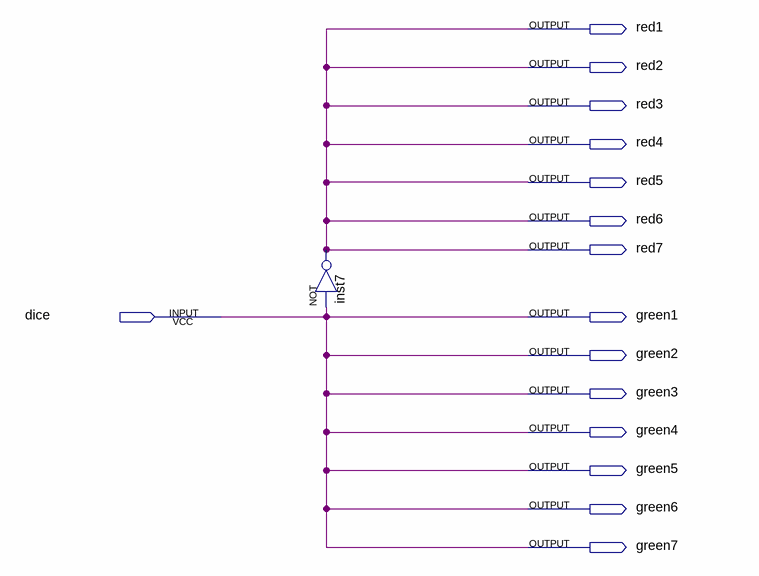
[diagram p0: schematic sheet]
// Quartus schematic dice.bdf as structural Verilog: 1 symbols, 15 pins
module dice (
  input  dice,
  output red1,
  output red2,
  output red3,
  output red4,
  output red5,
  output red6,
  output red7,
  output green1,
  output green2,
  output green3,
  output green4,
  output green5,
  output green6,
  output green7
);

  not inst7 (red1, dice);

  assign green1 = dice;
  assign green2 = dice;
  assign green3 = dice;
  assign green4 = dice;
  assign green5 = dice;
  assign green6 = dice;
  assign green7 = dice;
  assign red2 = red1;
  assign red3 = red1;
  assign red4 = red1;
  assign red5 = red1;
  assign red6 = red1;
  assign red7 = red1;
endmodule
